# Altium schematic sheet 01 - CML3 CONNECTOR.SchDoc
size 420 x 297 mm
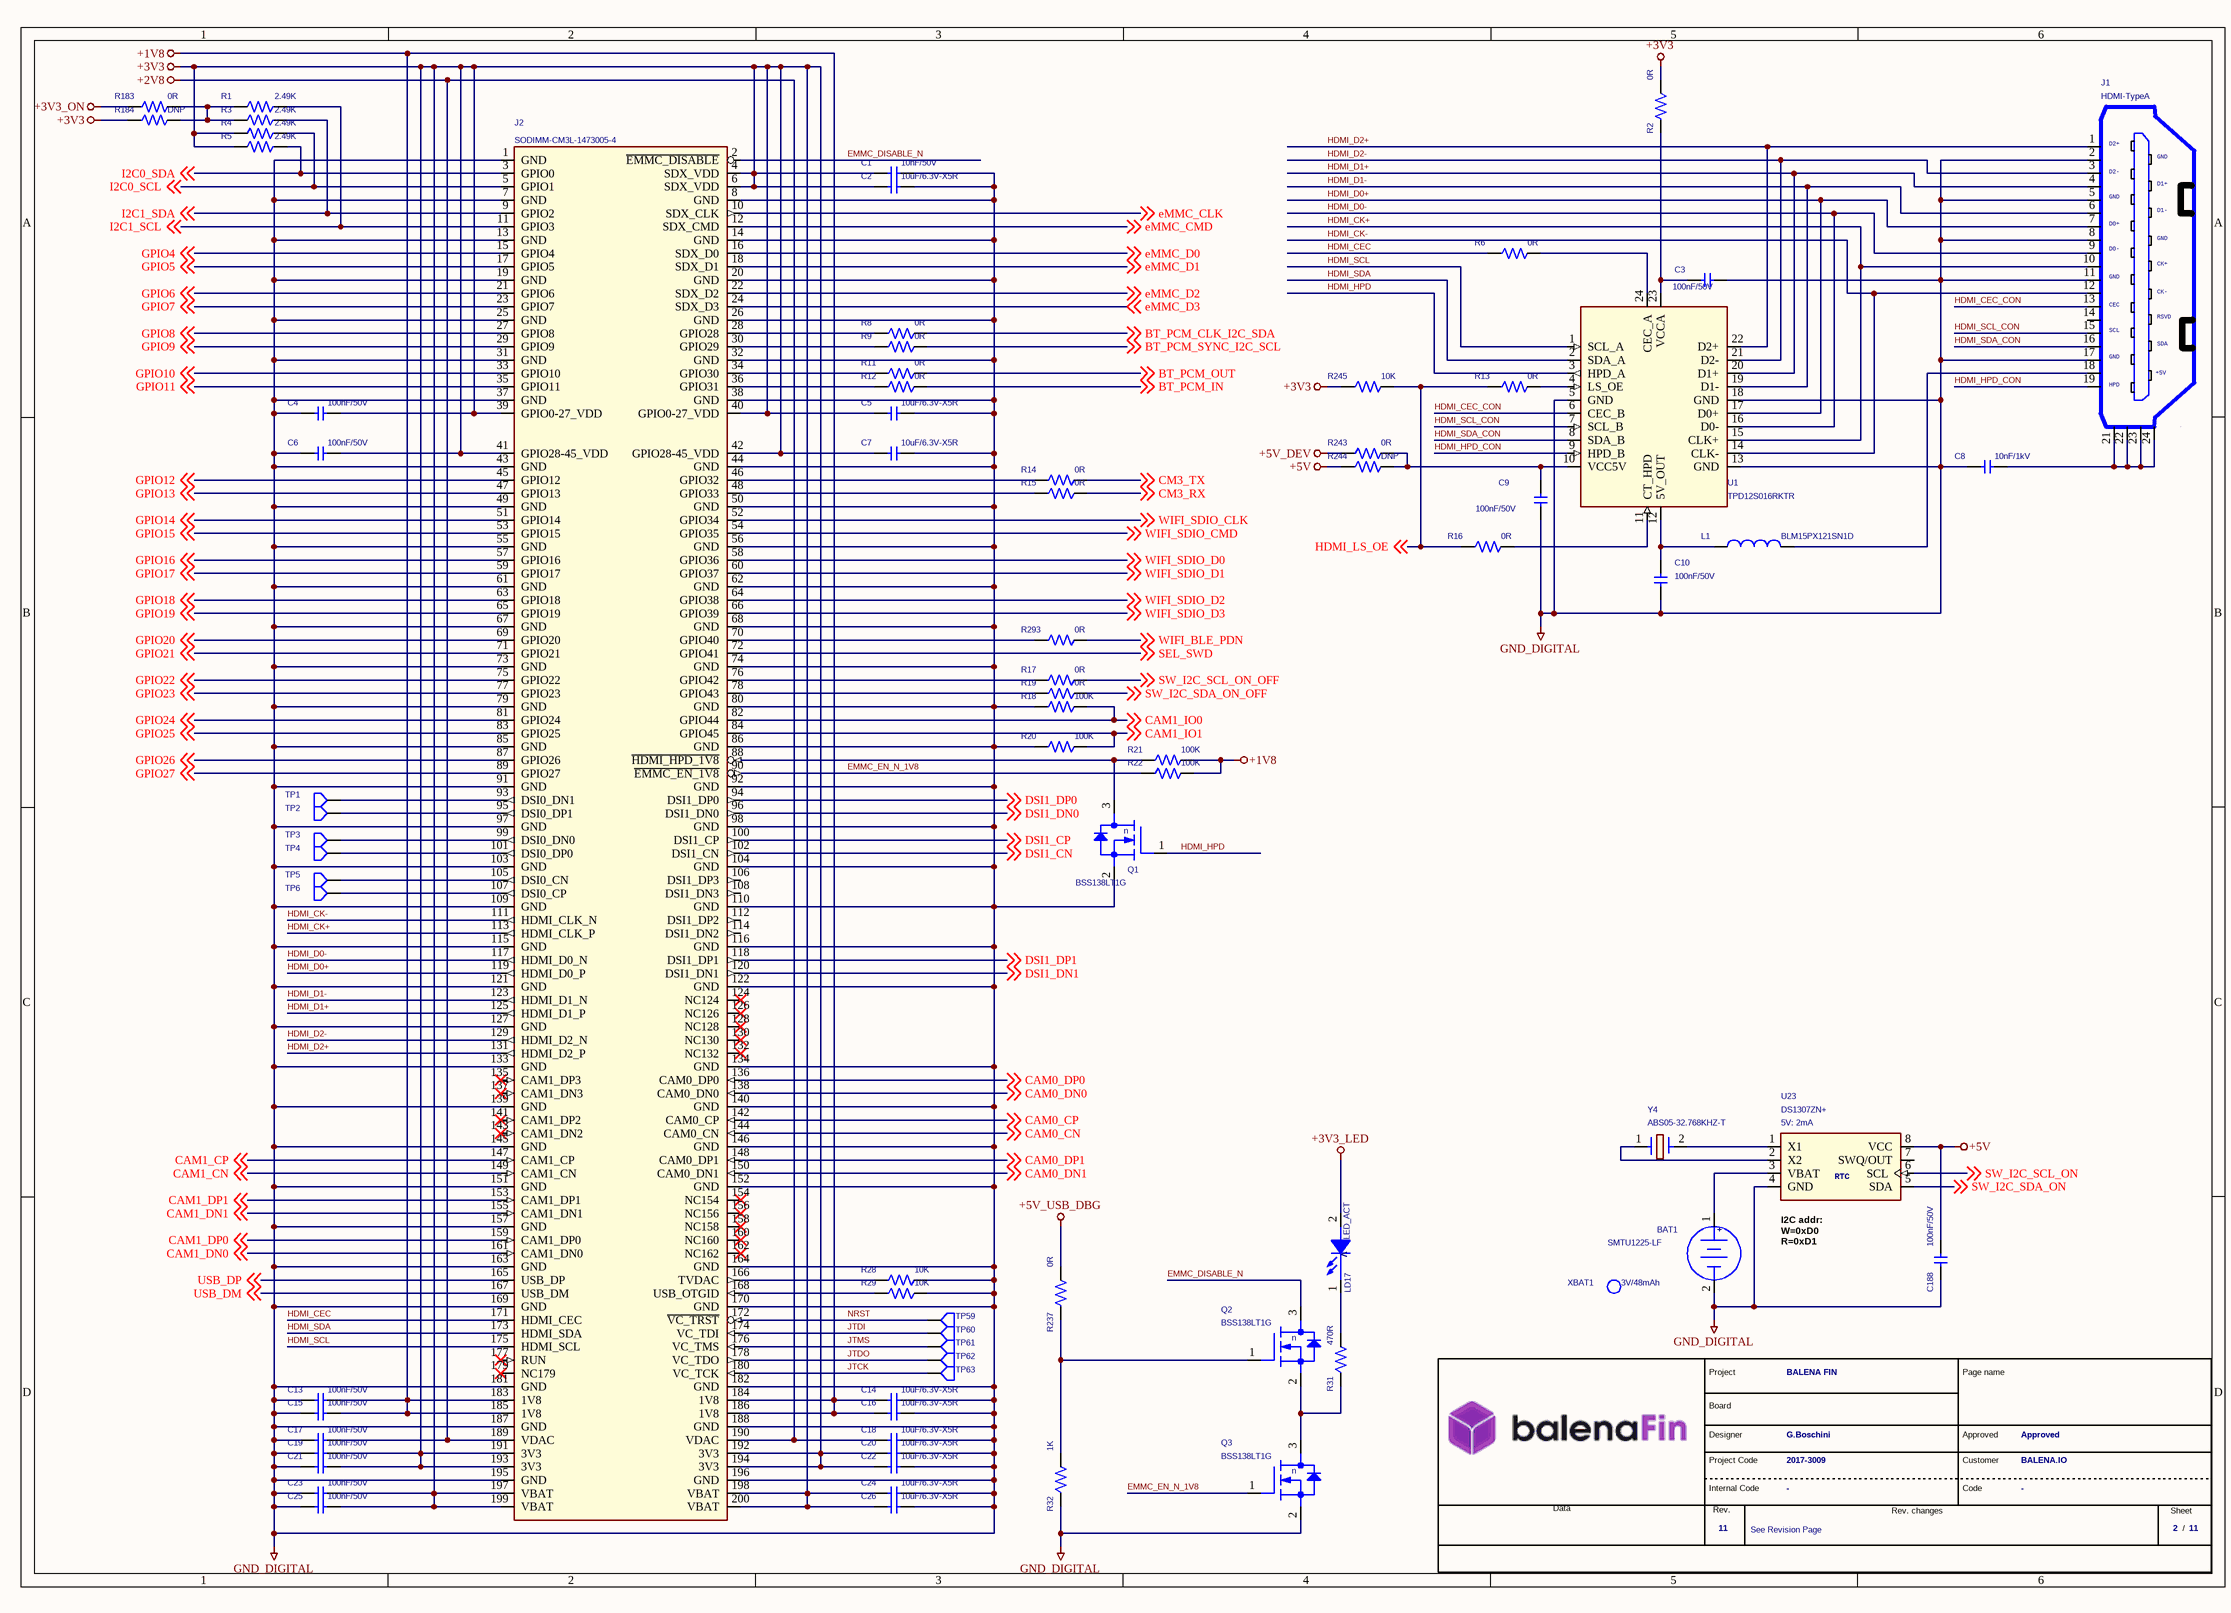
[diagram p0: 01 - CML3 CONNECTOR.SchDoc]

## Parts
*  Revision: 11  FAE RD code: 2017-3009  DocumentoRev: See Revision Page  Page Number: 2  Nome Progetto: BALENA FIN  Customer name: BALENA.IO  Project manager: Approved  Project designer: G.Boschini  (hidden comment: MyFAEVuoto)  (graphical)
BAT1  SMTU1225-LF  [BAT-SMTU1225]
C1  10nF/50V  [CS-C-0402]
C2  10uF/6.3V-X5R  [CS-C-0402]
C3  100nF/50V  [CS-C-0402]
C4  100nF/50V  [CS-C-0402]
C5  10uF/6.3V-X5R  [CS-C-0402]
C6  100nF/50V  [CS-C-0402]
C7  10uF/6.3V-X5R  [CS-C-0402]
C8  10nF/1kV  [CS-C-1206]
C9  100nF/50V  [CS-C-0402]
C10  100nF/50V  [CS-C-0402]
C13  100nF/50V  [CS-C-0402]
C14  10uF/6.3V-X5R  [CS-C-0402]
C15  100nF/50V  [CS-C-0402]
C16  10uF/6.3V-X5R  [CS-C-0402]
C17  100nF/50V  [CS-C-0402]
C18  10uF/6.3V-X5R  [CS-C-0402]
C19  100nF/50V  [CS-C-0402]
C20  10uF/6.3V-X5R  [CS-C-0402]
C21  100nF/50V  [CS-C-0402]
C22  10uF/6.3V-X5R  [CS-C-0402]
C23  100nF/50V  [CS-C-0402]
C24  10uF/6.3V-X5R  [CS-C-0402]
C25  100nF/50V  [CS-C-0402]
C26  10uF/6.3V-X5R  [CS-C-0402]
C188  100nF/50V  [CS-C-0402]
J1  HDMI-TypeA  [J-19-0050-FOS-HDMI-A-CNCTECH]
J2  SODIMM-CM3L-1473005-4  [J-200-0060-MOS-1473005-4]
L1  BLM15PX121SN1D  [LS-0402]
LD17  LED_ACT  [LD-0603]
Q1  BSS138LT1G  [SOT23]
Q2  BSS138LT1G  [SOT23]
Q3  BSS138LT1G  [SOT23]
R1  2.49K  [RS-0402]
R2  0R  [RS-0402]
R3  2.49K  [RS-0402]
R4  2.49K  [RS-0402]
R5  2.49K  [RS-0402]
R6  0R  [RS-0402]
R8  0R  [RS-0402]
R9  0R  [RS-0402]
R11  0R  [RS-0402]
R12  0R  [RS-0402]
R13  0R  [RS-0402]
R14  0R  [RS-0402]
R15  0R  [RS-0402]
R16  0R  [RS-0402]
R17  0R  [RS-0402]
R18  100K  [RS-0402]
R19  0R  [RS-0402]
R20  100K  [RS-0402]
R21  100K  [RS-0402]
R22  100K  [RS-0402]
R28  10K  [RS-0402]
R29  10K  [RS-0402]
R31  470R  [RS-0402]
R32  1K  [RS-0402]
R183  0R  [RS-0402]
R184  DNP  [RS-0402]
R237  0R  [RS-0402]
R243  0R  [RS-0402]
R244  DNP  [RS-0402]
R245  10K  [RS-0402]
R293  0R  [RS-0402]
TP1  TPS  [TPS-0100]  (value not drawn)  (no BOM)
TP2  TPS  [TPS-0100]  (value not drawn)  (no BOM)
TP3  TPS  [TPS-0100]  (value not drawn)  (no BOM)
TP4  TPS  [TPS-0100]  (value not drawn)  (no BOM)
TP5  TPS  [TPS-0100]  (value not drawn)  (no BOM)
TP6  TPS  [TPS-0100]  (value not drawn)  (no BOM)
TP59  TPS  [TPS-0100]  (value not drawn)  (no BOM)
TP60  TPS  [TPS-0100]  (value not drawn)  (no BOM)
TP61  TPS  [TPS-0100]  (value not drawn)  (no BOM)
TP62  TPS  [TPS-0100]  (value not drawn)  (no BOM)
TP63  TPS  [TPS-0100]  (value not drawn)  (no BOM)
U1  TPD12S016RKTR  [UFQFN24-4X2]
U23  DS1307ZN+  Power requirements: 5V: 2mA  [SOIC8]
XBAT1  3V/48mAh  (mechanical)
Y4  ABS05-32.768KHZ-T  [Y-ABS05]

## Nets
+1V8: C13.2 C14.1 C15.2 C16.1 J2.183(1V8) J2.184(1V8) J2.185(1V8) J2.186(1V8) R21.2 R22.2
+2V8: C17.2 C18.1 J2.189(VDAC) J2.190(VDAC)
+3V3: C1.1 C2.1 C4.2 C5.1 C6.2 C7.1 C19.2 C20.1 C21.2 C22.1 C23.2 C24.1 C25.2 C26.1 J2.4(SDX_VDD) J2.6(SDX_VDD) J2.39(GPIO0-27_VDD) J2.40(GPIO0-27_VDD) J2.41(GPIO28-45_VDD) J2.42(GPIO28-45_VDD) J2.191(3V3) J2.192(3V3) J2.193(3V3) J2.194(3V3) J2.197(VBAT) J2.198(VBAT) J2.199(VBAT) J2.200(VBAT) R2.2 R4.2 R5.2 R184.1 R245.1
+3V3_LED: LD17.2(A)
+3V3_ON: R183.1
+5V: C188.1 R244.1 U23.8(VCC)
+5V_DEV: R243.1
+5V_USB_DBG: R237.2
GND_DIGITAL: BAT1.2(-) C1.2 C2.2 C3.2 C4.1 C5.2 C6.1 C7.2 C8.1 C9.2 C10.2 C13.1 C14.2 C15.1 C16.2 C17.1 C18.2 C19.1 C20.2 C21.1 C22.2 C23.1 C24.2 C25.1 C26.2 C188.2 J1.2(GND_2) J1.5(GND_5) J1.8(GND_8) J1.11(GND_11) J1.17(GND_17) J2.1(GND) J2.7(GND) J2.8(GND) J2.13(GND) J2.14(GND) J2.19(GND) J2.20(GND) J2.25(GND) J2.26(GND) J2.31(GND) J2.32(GND) J2.37(GND) J2.38(GND) J2.43(GND) J2.44(GND) J2.49(GND) J2.50(GND) J2.55(GND) J2.56(GND) J2.61(GND) J2.62(GND) J2.67(GND) J2.68(GND) J2.73(GND) J2.74(GND) J2.79(GND) J2.80(GND) J2.85(GND) J2.86(GND) J2.91(GND) J2.92(GND) J2.97(GND) J2.98(GND) J2.103(GND) J2.104(GND) J2.109(GND) J2.110(GND) J2.115(GND) J2.116(GND) J2.121(GND) J2.122(GND) J2.127(GND) J2.133(GND) J2.134(GND) J2.139(GND) J2.140(GND) J2.145(GND) J2.146(GND) J2.151(GND) J2.152(GND) J2.157(GND) J2.163(GND) J2.164(GND) J2.169(GND) J2.170(GND) J2.181(GND) J2.182(GND) J2.187(GND) J2.188(GND) J2.195(GND) J2.196(GND) Q1.2(S) Q3.2(S) R18.1 R20.1 R28.2 R29.2 R32.1 U1.5(GND) U1.13(GND) U1.18(GND) U23.4(GND)
BT_PCM_CLK_I2C_SDA: R8.2 ; off-sheet BT_PCM_CLK_I2C_SDA
BT_PCM_IN: R12.2 ; off-sheet BT_PCM_IN
BT_PCM_OUT: R11.2 ; off-sheet BT_PCM_OUT
BT_PCM_SYNC_I2C_SCL: R9.2 ; off-sheet BT_PCM_SYNC_I2C_SCL
CAM0_CN: J2.144(CAM0_CN) ; off-sheet CAM0_CN
CAM0_CP: J2.142(CAM0_CP) ; off-sheet CAM0_CP
CAM0_DN0: J2.138(CAM0_DN0) ; off-sheet CAM0_DN0
CAM0_DN1: J2.150(CAM0_DN1) ; off-sheet CAM0_DN1
CAM0_DP0: J2.136(CAM0_DP0) ; off-sheet CAM0_DP0
CAM0_DP1: J2.148(CAM0_DP1) ; off-sheet CAM0_DP1
CAM1_CN: J2.149(CAM1_CN) ; off-sheet CAM1_CN
CAM1_CP: J2.147(CAM1_CP) ; off-sheet CAM1_CP
CAM1_DN0: J2.161(CAM1_DN0) ; off-sheet CAM1_DN0
CAM1_DN1: J2.155(CAM1_DN1) ; off-sheet CAM1_DN1
CAM1_DP0: J2.159(CAM1_DP0) ; off-sheet CAM1_DP0
CAM1_DP1: J2.153(CAM1_DP1) ; off-sheet CAM1_DP1
CAM1_IO0: J2.82(GPIO44) R18.2 ; off-sheet CAM1_IO0
CAM1_IO1: J2.84(GPIO45) R20.2 ; off-sheet CAM1_IO1
CM3_RX: R15.2 ; off-sheet CM3_RX
CM3_TX: R14.2 ; off-sheet CM3_TX
DSI1_CN: J2.102(DSI1_CN) ; off-sheet DSI1_CN
DSI1_CP: J2.100(DSI1_CP) ; off-sheet DSI1_CP
DSI1_DN0: J2.96(DSI1_DN0) ; off-sheet DSI1_DN0
DSI1_DN1: J2.120(DSI1_DN1) ; off-sheet DSI1_DN1
DSI1_DP0: J2.94(DSI1_DP0) ; off-sheet DSI1_DP0
DSI1_DP1: J2.118(DSI1_DP1) ; off-sheet DSI1_DP1
eMMC_CLK: J2.10(SDX_CLK) ; off-sheet eMMC_CLK
eMMC_CMD: J2.12(SDX_CMD) ; off-sheet eMMC_CMD
eMMC_D0: J2.16(SDX_D0) ; off-sheet eMMC_D0
eMMC_D1: J2.18(SDX_D1) ; off-sheet eMMC_D1
eMMC_D2: J2.22(SDX_D2) ; off-sheet eMMC_D2
eMMC_D3: J2.24(SDX_D3) ; off-sheet eMMC_D3
EMMC_DISABLE_N: J2.2(~{EMMC_DISABLE}) Q2.3(D)
EMMC_EN_N_1V8: J2.90(~{EMMC_EN_1V8}) Q3.1(G) R22.1
GPIO4: J2.15(GPIO4) ; off-sheet GPIO4
GPIO5: J2.17(GPIO5) ; off-sheet GPIO5
GPIO6: J2.21(GPIO6) ; off-sheet GPIO6
GPIO7: J2.23(GPIO7) ; off-sheet GPIO7
GPIO8: J2.27(GPIO8) ; off-sheet GPIO8
GPIO9: J2.29(GPIO9) ; off-sheet GPIO9
GPIO10: J2.33(GPIO10) ; off-sheet GPIO10
GPIO11: J2.35(GPIO11) ; off-sheet GPIO11
GPIO12: J2.45(GPIO12) ; off-sheet GPIO12
GPIO13: J2.47(GPIO13) ; off-sheet GPIO13
GPIO14: J2.51(GPIO14) ; off-sheet GPIO14
GPIO15: J2.53(GPIO15) ; off-sheet GPIO15
GPIO16: J2.57(GPIO16) ; off-sheet GPIO16
GPIO17: J2.59(GPIO17) ; off-sheet GPIO17
GPIO18: J2.63(GPIO18) ; off-sheet GPIO18
GPIO19: J2.65(GPIO19) ; off-sheet GPIO19
GPIO20: J2.69(GPIO20) ; off-sheet GPIO20
GPIO21: J2.71(GPIO21) ; off-sheet GPIO21
GPIO22: J2.75(GPIO22) ; off-sheet GPIO22
GPIO23: J2.77(GPIO23) ; off-sheet GPIO23
GPIO24: J2.81(GPIO24) ; off-sheet GPIO24
GPIO25: J2.83(GPIO25) ; off-sheet GPIO25
GPIO26: J2.87(GPIO26) ; off-sheet GPIO26
GPIO27: J2.89(GPIO27) ; off-sheet GPIO27
HDMI_CEC: J2.171(HDMI_CEC) R6.1
HDMI_CEC_CON: J1.13(CEC) U1.6(CEC_B)
HDMI_CK+: J1.10(CK+) J2.113(HDMI_CLK_P) U1.15(CLK+)
HDMI_CK-: J1.12(CK-) J2.111(HDMI_CLK_N) U1.14(CLK-)
HDMI_D0+: J1.7(D0+) J2.119(HDMI_D0_P) U1.17(D0+)
HDMI_D0-: J1.9(D0-) J2.117(HDMI_D0_N) U1.16(D0-)
HDMI_D1+: J1.4(D1+) J2.125(HDMI_D1_P) U1.20(D1+)
HDMI_D1-: J1.6(D1-) J2.123(HDMI_D1_N) U1.19(D1-)
HDMI_D2+: J1.1(D2+) J2.131(HDMI_D2_P) U1.22(D2+)
HDMI_D2-: J1.3(D2-) J2.129(HDMI_D2_N) U1.21(D2-)
HDMI_HPD: Q1.1(G) U1.3(HPD_A)
HDMI_HPD_CON: J1.19(HDP) U1.9(HPD_B)
HDMI_LS_OE: R13.1 R16.1 R245.2 ; off-sheet HDMI_LS_OE
HDMI_SCL: J2.175(HDMI_SCL) U1.1(SCL_A)
HDMI_SCL_CON: J1.15(SCL) U1.7(SCL_B)
HDMI_SDA: J2.173(HDMI_SDA) U1.2(SDA_A)
HDMI_SDA_CON: J1.16(SDA) U1.8(SDA_B)
I2C0_SCL: J2.5(GPIO1) R4.1 ; off-sheet I2C0_SCL
I2C0_SDA: J2.3(GPIO0) R5.1 ; off-sheet I2C0_SDA
I2C1_SCL: J2.11(GPIO3) R1.1 ; off-sheet I2C1_SCL
I2C1_SDA: J2.9(GPIO2) R3.1 ; off-sheet I2C1_SDA
JTCK: J2.180(VC_TCK) TP63.1(TP)
JTDI: J2.174(VC_TDI) TP60.1(TP)
JTDO: J2.178(VC_TDO) TP62.1(TP)
JTMS: J2.176(VC_TMS) TP61.1(TP)
NRST: J2.172(~{VC_TRST}) TP59.1(TP)
SEL_SWD: J2.72(GPIO41) ; off-sheet SEL_SWD
SW_I2C_SCL_ON: U23.6(SCL) ; off-sheet SW_I2C_SCL_ON
SW_I2C_SCL_ON_OFF: R17.2 ; off-sheet SW_I2C_SCL_ON_OFF
SW_I2C_SDA_ON: U23.5(SDA) ; off-sheet SW_I2C_SDA_ON
SW_I2C_SDA_ON_OFF: R19.2 ; off-sheet SW_I2C_SDA_ON_OFF
USB_DM: J2.167(USB_DM) ; off-sheet USB_DM
USB_DP: J2.165(USB_DP) ; off-sheet USB_DP
WIFI_BLE_PDN: R293.2 ; off-sheet WIFI_BLE_PDN
WIFI_SDIO_CLK: J2.52(GPIO34) ; off-sheet WIFI_SDIO_CLK
WIFI_SDIO_CMD: J2.54(GPIO35) ; off-sheet WIFI_SDIO_CMD
WIFI_SDIO_D0: J2.58(GPIO36) ; off-sheet WIFI_SDIO_D0
WIFI_SDIO_D1: J2.60(GPIO37) ; off-sheet WIFI_SDIO_D1
WIFI_SDIO_D2: J2.64(GPIO38) ; off-sheet WIFI_SDIO_D2
WIFI_SDIO_D3: J2.66(GPIO39) ; off-sheet WIFI_SDIO_D3
NetBAT1_1: BAT1.1(+) U23.3(VBAT)
NetC3_1: C3.1 R2.1 U1.23(VCCA)
NetC8_2: C8.2 J1.21(GND_21) J1.22(GND_22) J1.23(GND_23) J1.24(GND_24)
NetC9_1: C9.1 R243.2 R244.2 U1.10(VCC5V)
NetC10_1: C10.1 L1.1 U1.12(5V_OUT)
NetJ1_18: J1.18(+5V) L1.2
NetJ2_28: J2.28(GPIO28) R8.1
NetJ2_30: J2.30(GPIO29) R9.1
NetJ2_34: J2.34(GPIO30) R11.1
NetJ2_36: J2.36(GPIO31) R12.1
NetJ2_46: J2.46(GPIO32) R14.1
NetJ2_48: J2.48(GPIO33) R15.1
NetJ2_70: J2.70(GPIO40) R293.1
NetJ2_76: J2.76(GPIO42) R17.1
NetJ2_78: J2.78(GPIO43) R19.1
NetJ2_88: J2.88(~{HDMI_HPD_1V8}) Q1.3(D) R21.1
NetJ2_93: J2.93(DSI0_DN1) TP1.1(TP)
NetJ2_95: J2.95(DSI0_DP1) TP2.1(TP)
NetJ2_99: J2.99(DSI0_DN0) TP3.1(TP)
NetJ2_101: J2.101(DSI0_DP0) TP4.1(TP)
NetJ2_105: J2.105(DSI0_CN) TP5.1(TP)
NetJ2_107: J2.107(DSI0_CP) TP6.1(TP)
NetJ2_166: J2.166(TVDAC) R28.1
NetJ2_168: J2.168(USB_OTGID) R29.1
NetLD17_1: LD17.1(C) R31.2
NetQ2_1: Q2.1(G) R32.2 R237.1
NetQ2_2: Q2.2(S) Q3.3(D) R31.1
NetR1_2: R1.2 R3.2 R183.2 R184.2
NetR6_2: R6.2 U1.24(CEC_A)
NetR13_2: R13.2 U1.4(LS_OE)
NetR16_2: R16.2 U1.11(CT_HPD)
NetU23_1: U23.1(X1) Y4.2
NetU23_2: U23.2(X2) Y4.1

Not connected (* = marked no-connect by the designer): J1 14(RES); J2 106(DSI1_DP3) 108(DSI1_DN3) 112(DSI1_DP2) 114(DSI1_DN2) 124(NC124)* 126(NC126)* 128(NC128)* 130(NC130)* 132(NC132)* 135(CAM1_DP3)* 137(CAM1_DN3)* 141(CAM1_DP2)* 143(CAM1_DN2)* 154(NC154)* 156(NC156)* 158(NC158)* 160(NC160)* 162(NC162)* 177(RUN)* 179(NC179)*; U23 7(SWQ/OUT)

## Notes on the sheet
- (near U23) I2C addr:
  W=0xD0
  R=0xD1
- (in symbol HDMI - J-19-0050-FOS-HDMI-A-CNC) GND; RSVD; HPD
- (in symbol LED V - GENERICO - 0603) V
- (in symbol MyFAEVuoto) Project; Page name; Board; Designer; Project Code; Customer; Internal Code; Code; Data; Rev.; Rev. changes; Sheet; /
- (in symbol NMOS - BSS138 - 0.2A/50V) n

## Library data of the parts
BAT1 = PORTA BATTERIA - SMTU1225-LF: Coin Cell Battery Holders SFC - MNT FOR CR1225; Room: RTC; Pkg Type: SMD; Temperature range: -40°..+100°; MPN: SMTU1225-LF; Mount: Yes
C1 = CS-C-0402-10n/50V: CHIP CAP.CER. 10nF 50V 10% X7R 0402; MPN: Generic; Alternative MPN: C0402C103K5RACTU; Room: CM3L; Pkg Type: SMD; Mount: Yes
C2 C5 C7 C14 C16 C18 C20 C22 C24 C26 = CS-C-0402-10u/6V3-X5R: CHIP CAP.CER. 10uF 6.3V 20% X5R 0402; MPN: Generic; Alternative MPN: CC0402MRX5R5BB106; Pkg Type: SMD; Room: CM3L; Temperature range: -55°..+85°; Mount: Yes
C3 C9 C10 = CS-C-0402-100n/16V: CHIP CAP.CER. 100nF 16V 10% X7R 0402; MPN: Generic; Alternative MPN: C0402C104K4RACTU; Room: HDMI; Pkg Type: SMD; Mount: Yes
C4 C6 C13 C15 C17 C19 C21 C23 C25 = CS-C-0402-100n/16V: CHIP CAP.CER. 100nF 16V 10% X7R 0402; MPN: Generic; Alternative MPN: C0402C104K4RACTU; Room: CM3L; Pkg Type: SMD; Mount: Yes
C8 = CS-C-1206-10n/1kV: CHIP CAP.CER. 10nF 1000V 10% X7R 1206; MPN: Generic; Alternative MPN: GRM31CR73A103KW03L; Room: HDMI; Pkg Type: SMD; Mount: Yes
C188 = CS-C-0402-100n/16V: CHIP CAP.CER. 100nF 16V 10% X7R 0402; MPN: Generic; Alternative MPN: C0402C104K4RACTU; Room: RTC; Pkg Type: SMD; Mount: Yes
J1 = HDMI - J-19-0050-FOS-HDMI-A-CNC: HDMI Receptacle Connector - 19 Position Surface Mount, Right Angle; MPN: 2000-1-2-41-00-BK; Note: Full SMD; Pkg Type: SMD; Room: HDMI; Temperature range: -20°..+85°; Mount: Yes
J2 = SODIMM - CM3L - 1473005-4: 200 Position SODIMM DDR2 - SDRAM Socket Surface Mount, Right Angle; Power requirements: VBAT: 3.5W - 3V3: 250mA - 1V8: 250mA - VDAC:25mA - GPIO0-27-VDD: 50mA- GPIO28-45-VDD: 50mA - SDVDD:50mA; Pkg Type: SMD; Room: CM3L; Temperature range: -55°..+85°; MPN: 1473005-4; Mount: Yes
L1 = FIL-BLM15PX121SN1D- 120R/2A: FERRITE 120R 2A 25% 0402 BLM15PX121SN1D MURATA SMT; Room: HDMI; Pkg Type: SMD; Temperature range: -55°..+125°; MPN: BLM15PX121SN1D; Mount: Yes
LD17 = LED V - GENERICO - 0603: LED Green 0603 SMT; Alternative MPN: KP-1608SGC; Pkg Type: SMD; Note: V=2.2V/20mA; Room: CM3L; MPN: Generic; Mount: Yes
Q1 = NMOS - BSS138 - 0.2A/50V: MOSFET N-CH 50V 220MA SOT23-3; Room: HDMI; Pkg Type: SMD; MPN: BSS138LT1G; Mount: Yes
Q2 Q3 = NMOS - BSS138 - 0.2A/50V: MOSFET N-CH 50V 220MA SOT23-3; Room: CM3L; Pkg Type: SMD; MPN: BSS138LT1G; Mount: Yes
R1 R3-R5 = RS-0402-2.49k: CHIP RES. 2K49 0402 1/16W 1% 100PPM/°C; MPN: Generic; Room: CM3L; Note: 100ppm; Pkg Type: SMD; Mount: Yes
R2 R6 R8 R9 R11-R17 R19 R183 R237 R243 R293 = RS-0402-0r: CHIP RES. 0R 0402 1/16W 1%; MPN: Generic; Room: CM3L; Pkg Type: SMD; Mount: Yes
R18 R20 = RS-0402-100k: CHIP RES. 100K 0402 1/16W 1%; MPN: Generic; Pkg Type: SMD; Room: CM3L; Mount: Yes
R21 R22 = RS-0402-100k: CHIP RES. 100K 0402 1/16W 1%; MPN: Generic; Pkg Type: SMD; Room: HDMI; Mount: Yes
R28 R29 = RS-0402-10k: CHIP RES. 10K 0402 1/16W 1%; MPN: Generic; Room: CM3L; Pkg Type: SMD; Temperature range: -55°..+125°; Mount: Yes
R31 = RS-0402-470r: CHIP RES. 470R 0402 1/16W 1%; MPN: Generic; Pkg Type: SMD; Room: CM3L; Mount: Yes
R32 = RS-0402-1k: CHIP RES. 1K 0402 1/16W 1%; MPN: Generic; Pkg Type: SMD; Room: POWER LED; Mount: Yes
R184 = RS-0402: CHIP RES. 0R 0402 1/10W 1%; MPN: Generic; Pkg Type: SMD; Room: HUB-USB; Mount: No
R244 = RS-0402: CHIP RES. 0402; MPN: Generic; Pkg Type: SMD; Mount: No
R245 = RS-0402-10k: CHIP RES. 10K 0402 1/16W 1%; MPN: Generic; Room: HDMI; Pkg Type: SMD; Temperature range: -55°..+125°; Mount: Yes
TP1-TP6 TP59-TP63 = TEST POINT SMD 1 MM: TEST POINT SMD; MPN: TP-No-BoM; Pkg Type: SMD; Mount: Yes
U1 = HDMI-TPD12S016RKTR-ESD PROTECT: HDMI, I²C Buffer, ESD Protection Interface 24-UQFN (4x2); Power requirements: 5V: 100mA - 3V:50uA; Pkg Type: SMD; Room: HDMI; Temperature range: -40° - +85°; MPN: TPD12S016RKTR; Mount: Yes
U23 = RTC - DS1307ZN+: IC RTC CLK/CALENDAR I2C 8-SOIC; Pkg Type: SMD; Room: RTC; Temperature range: -40°..+85°; MPN: DS1307ZN+; Mount: Yes
XBAT1 = LITIO - CR1225 - 48mAh/3V: LITHUM BATTERY 3V 48mAh (-30 / +70°C) CR1225; MPN: CR1225FV-LF; Pkg Type: THT; Room: RTC; Temperature range: -30°..+70°; Mount: Yes
Y4 = QUARZO-ABS05-32.768KHZ-T: 32.768kHz ±20ppm Crystal 12.5pF 90 kOhms 2-SMD, No  Lead D=1.6x1; Room: RTC; Note: CL=12.5p; Pkg Type: SMD; Temperature range: -40°..+85°; MPN: ABS05-32.768KHZ-T; Mount: Yes
* = MyFAEVuoto: Page Count: 11; Customer Code: -; Database: -